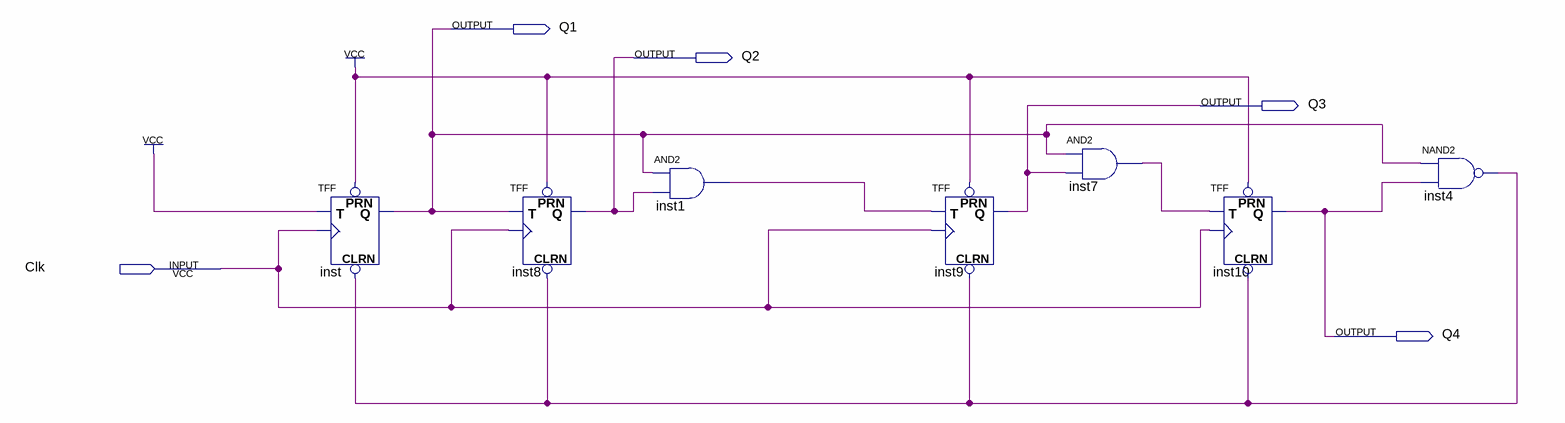
[diagram p0: schematic sheet]
// Quartus schematic lab10step3a.bdf as structural Verilog: 7 symbols, 5 pins
module lab10step3a (
  input  Clk,
  output Q1,
  output Q2,
  output Q3,
  output Q4
);

  wire inst1_out, inst4_out, inst7_out;

  TFF inst (.PRN(1'b1), .CLRN(inst4_out), .T(1'b1), .CLK(Clk), .Q(Q1));
  TFF inst8 (.PRN(1'b1), .CLRN(inst4_out), .T(Q1), .CLK(Clk), .Q(Q2));
  and inst1 (inst1_out, Q1, Q2);
  TFF inst9 (.PRN(1'b1), .CLRN(inst4_out), .T(inst1_out), .CLK(Clk), .Q(Q3));
  and inst7 (inst7_out, Q1, Q3);
  TFF inst10 (.PRN(1'b1), .CLRN(inst4_out), .T(inst7_out), .CLK(Clk), .Q(Q4));
  nand inst4 (inst4_out, Q1, Q4);
endmodule
